# Altium schematic sheet mcu.SchDoc
size A4
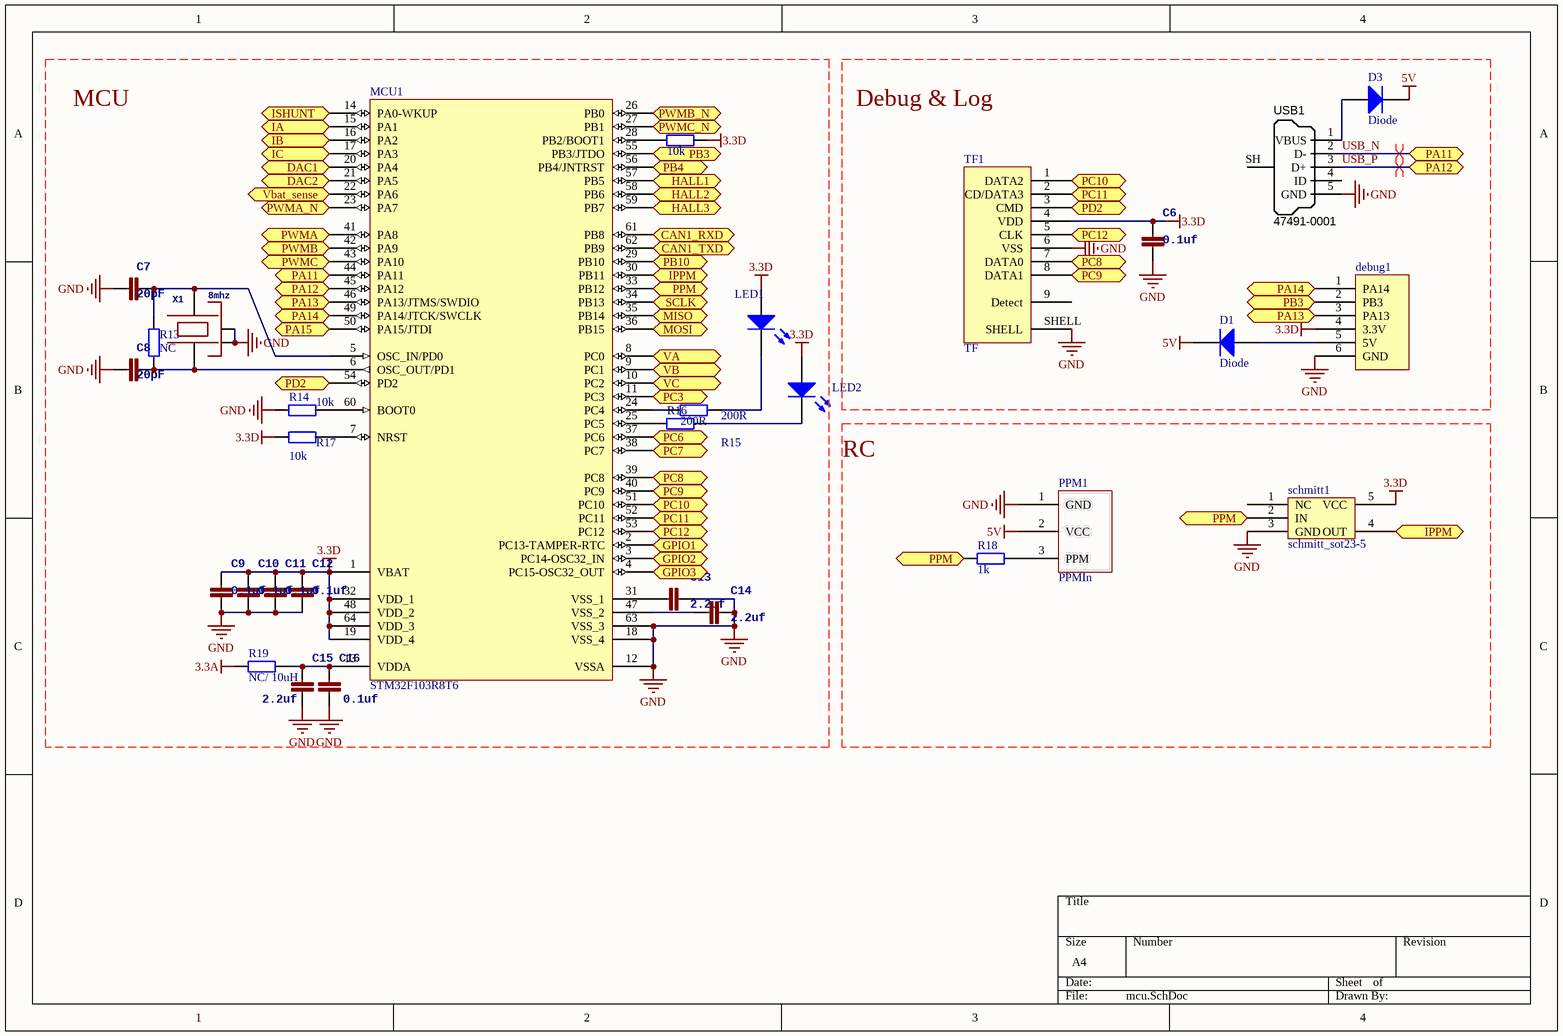
[diagram p0: mcu.SchDoc]

## Parts
C6  0.1uf  [0603]
C7  20pF  [0603]
C8  20pF  [0603]
C9  0.1uf  [0603]
C10  0.1uf  [0603]
C11  0.1uf  [0603]
C12  0.1uf  [0603]
C13  2.2uf  [0603]
C14  2.2uf  [0603]
C15  2.2uf  [0603]
C16  0.1uf  [0603]
D1  Diode  [0805]
D3  Diode  [0805]
debug1  debug  [WFRSM125]  (value not drawn)
LED1  LED0  [0603]  (value not drawn)
LED2  LED0  [0603]  (value not drawn)
MCU1  STM32F103R8T6  [LQFP64_N]
PPM1  PPMIn  [ServoConnector]
R12  10k  [0603]
R13  NC  [0603]
R14  10k  [0603]
R15  200R  [0603]
R16  200R  [0603]
R17  10k  [0603]
R18  1k  [0603]
R19  NC/ 10uH  [0603]
schmitt1  schmitt_sot23-5  [SOT23-5]
TF1  TF  [TF]
USB1  Manufacturer Part Number 1: 47491-0001  [MOLEX-47346-0001]  (hidden comment: USB Micro Type B)
X1  8mhz  [OSCILLATOR-3.2X2.5]

## Ports
CAN1_RXD, CAN1_TXD, DAC1, DAC2, GPIO1, GPIO2, GPIO3, HALL1, HALL2, HALL3, IA, IB, IC, IPPM, ISHUNT, MISO, MOSI, PA11, PA12, PA13, PA14, PA15, PB3, PB4, PB10, PC3, PC6, PC7, PC8, PC9, PC10, PC11, PC12, PD2, PPM, PWMA, PWMA_N, PWMB, PWMB_N, PWMC, PWMC_N, SCLK, VA, VB, Vbat_sense, VC

## Nets
3.3A: R19.2
3.3D: C6.2 C9.2 C10.2 C11.2 C12.2 debug1.4(3.3V) LED1.1(A) LED2.1(A) MCU1.1(VBAT) MCU1.19(VDD_4) MCU1.32(VDD_1) MCU1.48(VDD_2) MCU1.64(VDD_3) R12.2 R17.2 schmitt1.5(VCC) TF1.4(VDD)
5V: D1.2(K) D3.2(K) PPM1.2(VCC)
GND: C6.1 C7.2 C8.2 C9.1 C10.1 C11.1 C12.1 C13.2 C14.2 C15.1 C16.1 debug1.6(GND) MCU1.12(VSSA) MCU1.18(VSS_4) MCU1.63(VSS_3) PPM1.1(GND) R14.1 schmitt1.3(GND) TF1.6(VSS) TF1.SHELL USB1.5(GND) X1.2(NC_2) X1.4(NC_4)
CAN1_RXD: MCU1.61(PB8) ; port CAN1_RXD
CAN1_TXD: MCU1.62(PB9) ; port CAN1_TXD
DAC1: MCU1.20(PA4) ; port DAC1
DAC2: MCU1.21(PA5) ; port DAC2
GPIO1: MCU1.2(PC13-TAMPER-RTC) ; port GPIO1
GPIO2: MCU1.3(PC14-OSC32_IN) ; port GPIO2
GPIO3: MCU1.4(PC15-OSC32_OUT) ; port GPIO3
HALL1: MCU1.57(PB5) ; port HALL1
HALL2: MCU1.58(PB6) ; port HALL2
HALL3: MCU1.59(PB7) ; port HALL3
IA: MCU1.15(PA1) ; port IA
IB: MCU1.16(PA2) ; port IB
IC: MCU1.17(PA3) ; port IC
IPPM: MCU1.30(PB11) schmitt1.4(OUT) ; port IPPM
ISHUNT: MCU1.14(PA0-WKUP) ; port ISHUNT
MISO: MCU1.35(PB14) ; port MISO
MOSI: MCU1.36(PB15) ; port MOSI
PA13: debug1.3(PA13) MCU1.46(PA13/JTMS/SWDIO) ; port PA13
PA14: debug1.1(PA14) MCU1.49(PA14/JTCK/SWCLK) ; port PA14
PA15: MCU1.50(PA15/JTDI) ; port PA15
PB3: debug1.2(PB3) MCU1.55(PB3/JTDO) ; port PB3
PB4: MCU1.56(PB4/JNTRST) ; port PB4
PB10: MCU1.29(PB10) ; port PB10
PC3: MCU1.11(PC3) ; port PC3
PC6: MCU1.37(PC6) ; port PC6
PC7: MCU1.38(PC7) ; port PC7
PC8: MCU1.39(PC8) TF1.7(DATA0) ; port PC8
PC9: MCU1.40(PC9) TF1.8(DATA1) ; port PC9
PC10: MCU1.51(PC10) TF1.1(DATA2) ; port PC10
PC11: MCU1.52(PC11) TF1.2(CD/DATA3) ; port PC11
PC12: MCU1.53(PC12) TF1.5(CLK) ; port PC12
PD2: MCU1.54(PD2) TF1.3(CMD) ; port PD2
PPM: MCU1.33(PB12) R18.2 schmitt1.2(IN) ; port PPM
PWMA: MCU1.41(PA8) ; port PWMA
PWMA_N: MCU1.23(PA7) ; port PWMA_N
PWMB: MCU1.42(PA9) ; port PWMB
PWMB_N: MCU1.26(PB0) ; port PWMB_N
PWMC: MCU1.43(PA10) ; port PWMC
PWMC_N: MCU1.27(PB1) ; port PWMC_N
SCLK: MCU1.34(PB13) ; port SCLK
USB_N: MCU1.44(PA11) USB1.2(D-) ; port PA11
USB_P: MCU1.45(PA12) USB1.3(D+) ; port PA12
VA: MCU1.8(PC0) ; port VA
VB: MCU1.9(PC1) ; port VB
Vbat_sense: MCU1.22(PA6) ; port Vbat_sense
VC: MCU1.10(PC2) ; port VC
NetC7_1: C7.1 MCU1.5(OSC_IN/PD0) R13.2 X1.3
NetC8_1: C8.1 MCU1.6(OSC_OUT/PD1) R13.1 X1.1
NetC13_1: C13.1 MCU1.31(VSS_1)
NetC14_1: C14.1 MCU1.47(VSS_2)
NetC15_2: C15.2 C16.2 MCU1.13(VDDA) R19.1
NetD1_1: D1.1(A) debug1.5(5V)
NetD3_1: D3.1(A) USB1.1(VBUS)
NetLED1_2: LED1.2(K) R15.2
NetLED2_2: LED2.2(K) R16.2
NetMCU1_7: MCU1.7(NRST) R17.1
NetMCU1_24: MCU1.24(PC4) R15.1
NetMCU1_25: MCU1.25(PC5) R16.1
NetMCU1_28: MCU1.28(PB2/BOOT1) R12.1
NetMCU1_60: MCU1.60(BOOT0) R14.2
NetPPM1_3: PPM1.3(PPM) R18.1

Not connected (* = marked no-connect by the designer): schmitt1 1(NC); TF1 9(Detect); USB1 4(ID) SH(Shell)

## Layout directives
differential pair: USB_N, USB_P

## Notes on the sheet
- MCU
- Debug & Log
- RC

## Library data of the parts
C6-C16 = CAP0402-CAP: 电容; PARTNO: CC0402ZRY5V7BB104
D1 D3 = Diode: Default Diode; Published: 8-Jun-2000; LatestRevisionDate: 17-Jul-2002; LatestRevisionNote: Re-released for DXP Platform.; PackageVersion: Sep-1996; PackageReference: SMC; Publisher: Altium Limited; PackageDescription: DO-214-AB/SMC; 2 C-Bend Leads; Body 7.9 x 5.9 mm, inc. leads (LxW); Code_JEDEC: DO-214-AB
LED1 LED2 = LED0: Typical INFRARED GaAs LED; Published: 8-Jun-2000; LatestRevisionDate: 08-Jul-2005; LatestRevisionNote: Mech Layer 1 removed.; PackageReference: LED-0; Publisher: Altium Limited; PackageDescription: LED; 2 Leads
MCU1 = STM32F103R8T6: STM32 ARM-based 32-bit MCU with 64 Kbytes Flash, 64-pin LQFP, Industrial Temperature; Published: *; DatasheetVersion: *; PackageVersion: *; PackageReference: *; Publisher: *; PackageDescription: *; ComponentLink1Description: *; ComponentLink1URL: *; ComponentLink2Description: *; ComponentLink2URL: *
R12-R19 = Res2: 电阻; Value: 0Ohm; Published: 8-Jun-2000; LatestRevisionDate: 17-Jul-2002; LatestRevisionNote: Re-released for DXP Platform.; PackageReference: AXIAL-0.4; Publisher: Altium Limited; PackageDescription: Axial Device, Thru-Hole; 2 Leads; 0.4 in Pin Spacing
USB1 = USB_Micro_TypeB: Connector SMD USB Micro Type B middle mount; Manufacturer 1: Molex Inc; SCDType: undef; Package / Case: SMD; Supplier 1: Digi-Key; Supplier Part Number 1: WM17142CT-ND
X1 = OSCILLATOR-3.2X2.5: Crystal Oscillator in 3.2x2.5 SMD